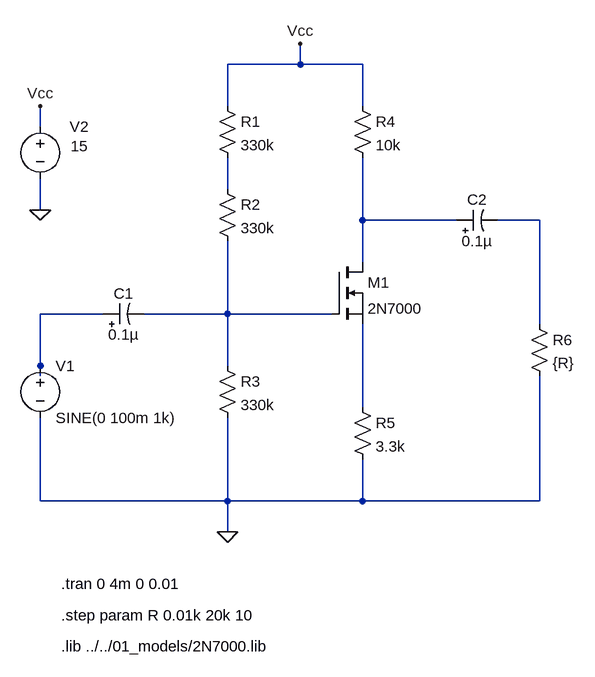
[diagram p0: schematic moschar_04_02_02_mosamp_rout.asc]
moschar_04_02_02_mosamp_rout.asc, the LTspice schematic file:
Version 4
SHEET 1 5032 1768
WIRE 3392 432 3392 400
WIRE 3392 432 3280 432
WIRE 3488 432 3392 432
WIRE 3280 496 3280 432
WIRE 3488 496 3488 432
WIRE 2992 528 2992 496
WIRE 3280 624 3280 576
WIRE 2992 656 2992 608
WIRE 3488 672 3488 576
WIRE 3632 672 3488 672
WIRE 3760 672 3696 672
WIRE 3488 736 3488 672
WIRE 3088 816 2992 816
WIRE 3280 816 3280 704
WIRE 3280 816 3152 816
WIRE 3440 816 3280 816
WIRE 3760 832 3760 672
WIRE 2992 896 2992 816
WIRE 3280 896 3280 816
WIRE 2992 912 2992 896
WIRE 3488 960 3488 832
WIRE 2992 1104 2992 976
WIRE 3280 1104 3280 976
WIRE 3280 1104 2992 1104
WIRE 3488 1104 3488 1040
WIRE 3488 1104 3280 1104
WIRE 3760 1104 3760 912
WIRE 3760 1104 3488 1104
WIRE 3280 1152 3280 1104
FLAG 3280 1152 0
FLAG 2992 656 0
FLAG 2992 496 Vcc
FLAG 3392 400 Vcc
SYMBOL nmos 3440 736 R0
SYMATTR InstName M1
SYMATTR Value 2N7000
SYMBOL res 3264 480 R0
SYMATTR InstName R1
SYMATTR Value 330k
SYMBOL res 3264 608 R0
SYMATTR InstName R2
SYMATTR Value 330k
SYMBOL res 3264 880 R0
SYMATTR InstName R3
SYMATTR Value 330k
SYMBOL res 3472 480 R0
SYMATTR InstName R4
SYMATTR Value 10k
SYMBOL res 3472 944 R0
SYMATTR InstName R5
SYMATTR Value 3.3k
SYMBOL polcap 3088 832 R270
WINDOW 0 32 32 VTop 2
WINDOW 3 0 32 VBottom 2
SYMATTR InstName C1
SYMATTR Value 0.1µ
SYMBOL voltage 2992 880 R0
WINDOW 123 0 0 Left 2
WINDOW 39 0 0 Left 2
SYMATTR InstName V1
SYMATTR Value SINE(0 100m 1k)
SYMBOL voltage 2992 512 R0
WINDOW 3 47 46 Left 2
WINDOW 123 0 0 Left 2
WINDOW 39 0 0 Left 2
WINDOW 0 45 16 Left 2
SYMATTR Value 15
SYMATTR InstName V2
SYMBOL polcap 3632 688 R270
WINDOW 0 32 32 VTop 2
WINDOW 3 0 32 VBottom 2
SYMATTR InstName C2
SYMATTR Value 0.1µ
SYMBOL res 3744 816 R0
SYMATTR InstName R6
SYMATTR Value {R}
TEXT 3024 1232 Left 2 !.tran 0 4m 0 0.01
TEXT 3024 1280 Left 2 !.step param R 0.01k 20k 10
TEXT 3024 1328 Left 2 !.lib ../../01_models/2N7000.lib

The netlist it stands for:
* moschar_04_02_02_mosamp_rout.asc
M1 N002 N005 N006 N006 2N7000
R1 Vcc N001 330k
R2 N001 N005 330k
R3 N005 0 330k
R4 Vcc N002 10k
R5 N006 0 3.3k
C1 N004 N005 0.1µ
V1 N004 0 SINE(0 100m 1k)
V2 Vcc 0 15
C2 N002 N003 0.1µ
R6 N003 0 {R}
.model NMOS NMOS
.model PMOS PMOS
.lib standard.mos
.tran 0 4m 0 0.01
.step param R 0.01k 20k 10
.lib ../../01_models/2N7000.lib
.backanno
.end